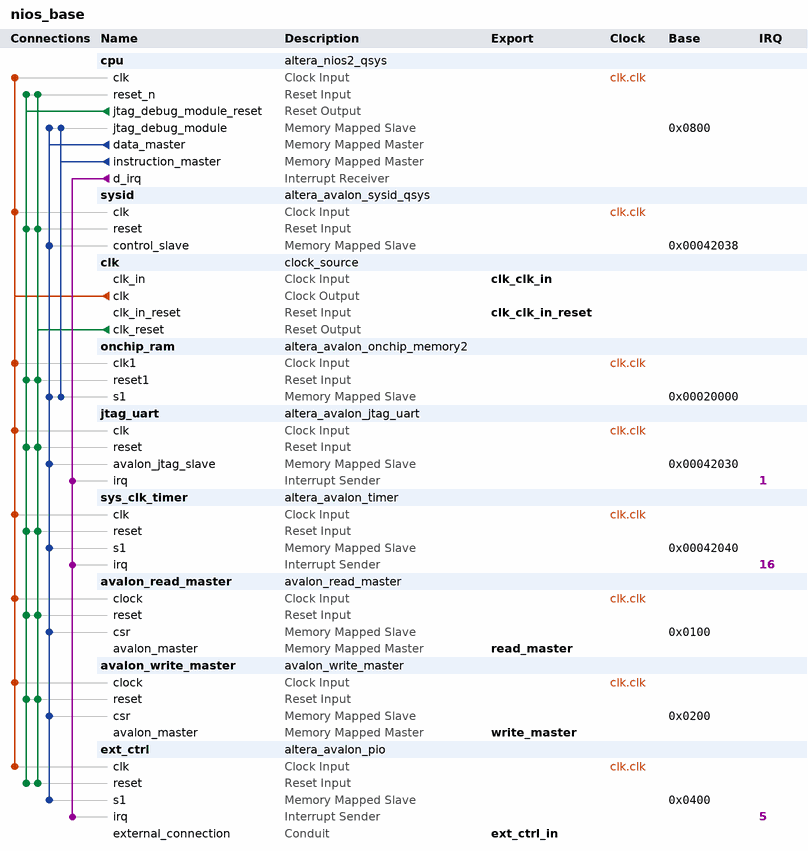
[diagram p0: system contents]
# Platform Designer (Qsys) system nios_base
# Parameters at their usual value, and those the tool derives, are not listed.
package require -exact qsys 11.0
create_system nios_base
set_project_property DEVICE_FAMILY STRATIXIV

add_instance cpu altera_nios2_qsys 11.0
set_instance_parameter_value cpu manuallyAssignCpuID false
set_instance_parameter_value cpu resetSlave onchip_ram.s1
set_instance_parameter_value cpu exceptionSlave onchip_ram.s1
set_instance_parameter_value cpu breakSlave cpu.jtag_debug_module
set_instance_parameter_value cpu muldiv_multiplierType NoneSmall
set_instance_parameter_value cpu mmu_processIDNumBits 10
set_instance_parameter_value cpu impl Tiny
set_instance_parameter_value cpu icache_size 4096

add_instance sysid altera_avalon_sysid_qsys 11.0
set_instance_parameter_value sysid id 953745243

add_instance clk clock_source 11.0
set_instance_parameter_value clk clockFrequency 50000000

add_instance onchip_ram altera_avalon_onchip_memory2 11.0
set_instance_parameter_value onchip_ram dataWidth 32
set_instance_parameter_value onchip_ram dualPort false
set_instance_parameter_value onchip_ram initMemContent true
set_instance_parameter_value onchip_ram initializationFileName onchip_ram
set_instance_parameter_value onchip_ram memorySize 131072

add_instance jtag_uart altera_avalon_jtag_uart 11.0
set_instance_parameter_value jtag_uart simInteractiveOptions INTERACTIVE_ASCII_OUTPUT

add_instance sys_clk_timer altera_avalon_timer 11.0
set_instance_parameter_value sys_clk_timer alwaysRun true
set_instance_parameter_value sys_clk_timer fixedPeriod true
set_instance_parameter_value sys_clk_timer period 10.0
set_instance_parameter_value sys_clk_timer periodUnits MSEC
set_instance_parameter_value sys_clk_timer snapshot false
set_instance_parameter_value sys_clk_timer timerPreset SIMPLE_PERIODIC_INTERRUPT

add_instance avalon_read_master avalon_read_master 1.0
set_instance_parameter_value avalon_read_master DATAWIDTH 32
set_instance_parameter_value avalon_read_master BYTEENABLEWIDTH 4
set_instance_parameter_value avalon_read_master ADDRESSWIDTH 32
set_instance_parameter_value avalon_read_master FIFODEPTH 32
set_instance_parameter_value avalon_read_master FIFODEPTH_LOG2 5
set_instance_parameter_value avalon_read_master FIFOUSEMEMORY 1

add_instance avalon_write_master avalon_write_master 1.0
set_instance_parameter_value avalon_write_master DATAWIDTH 32
set_instance_parameter_value avalon_write_master BYTEENABLEWIDTH 4
set_instance_parameter_value avalon_write_master ADDRESSWIDTH 32
set_instance_parameter_value avalon_write_master FIFODEPTH 32
set_instance_parameter_value avalon_write_master FIFODEPTH_LOG2 5
set_instance_parameter_value avalon_write_master FIFOUSEMEMORY 1

add_instance ext_ctrl altera_avalon_pio 11.0
set_instance_parameter_value ext_ctrl captureEdge true
set_instance_parameter_value ext_ctrl direction Input
set_instance_parameter_value ext_ctrl generateIRQ true
set_instance_parameter_value ext_ctrl irqType EDGE
set_instance_parameter_value ext_ctrl width 4

# connections
add_connection clk.clk avalon_read_master.clock clock
add_connection clk.clk avalon_write_master.clock clock
add_connection clk.clk cpu.clk clock
add_connection clk.clk ext_ctrl.clk clock
add_connection clk.clk jtag_uart.clk clock
add_connection clk.clk onchip_ram.clk1 clock
add_connection clk.clk sys_clk_timer.clk clock
add_connection clk.clk sysid.clk clock
add_connection clk.clk_reset avalon_read_master.reset reset
add_connection clk.clk_reset avalon_write_master.reset reset
add_connection clk.clk_reset cpu.reset_n reset
add_connection clk.clk_reset ext_ctrl.reset reset
add_connection clk.clk_reset jtag_uart.reset reset
add_connection clk.clk_reset onchip_ram.reset1 reset
add_connection clk.clk_reset sys_clk_timer.reset reset
add_connection clk.clk_reset sysid.reset reset
add_connection cpu.jtag_debug_module_reset avalon_read_master.reset reset
add_connection cpu.jtag_debug_module_reset avalon_write_master.reset reset
add_connection cpu.jtag_debug_module_reset cpu.reset_n reset
add_connection cpu.jtag_debug_module_reset ext_ctrl.reset reset
add_connection cpu.jtag_debug_module_reset jtag_uart.reset reset
add_connection cpu.jtag_debug_module_reset onchip_ram.reset1 reset
add_connection cpu.jtag_debug_module_reset sys_clk_timer.reset reset
add_connection cpu.jtag_debug_module_reset sysid.reset reset
add_connection cpu.data_master avalon_read_master.csr avalon
set_connection_parameter_value cpu.data_master/avalon_read_master.csr baseAddress 0x0100
add_connection cpu.data_master avalon_write_master.csr avalon
set_connection_parameter_value cpu.data_master/avalon_write_master.csr baseAddress 0x0200
add_connection cpu.data_master cpu.jtag_debug_module avalon
set_connection_parameter_value cpu.data_master/cpu.jtag_debug_module baseAddress 0x0800
add_connection cpu.data_master ext_ctrl.s1 avalon
set_connection_parameter_value cpu.data_master/ext_ctrl.s1 baseAddress 0x0400
add_connection cpu.data_master jtag_uart.avalon_jtag_slave avalon
set_connection_parameter_value cpu.data_master/jtag_uart.avalon_jtag_slave baseAddress 0x00042030
add_connection cpu.data_master onchip_ram.s1 avalon
set_connection_parameter_value cpu.data_master/onchip_ram.s1 baseAddress 0x00020000
add_connection cpu.data_master sys_clk_timer.s1 avalon
set_connection_parameter_value cpu.data_master/sys_clk_timer.s1 baseAddress 0x00042040
add_connection cpu.data_master sysid.control_slave avalon
set_connection_parameter_value cpu.data_master/sysid.control_slave baseAddress 0x00042038
add_connection cpu.instruction_master cpu.jtag_debug_module avalon
set_connection_parameter_value cpu.instruction_master/cpu.jtag_debug_module baseAddress 0x0800
add_connection cpu.instruction_master onchip_ram.s1 avalon
set_connection_parameter_value cpu.instruction_master/onchip_ram.s1 baseAddress 0x00020000
add_connection cpu.d_irq ext_ctrl.irq interrupt
set_connection_parameter_value cpu.d_irq/ext_ctrl.irq irqNumber 5
add_connection cpu.d_irq jtag_uart.irq interrupt
set_connection_parameter_value cpu.d_irq/jtag_uart.irq irqNumber 1
add_connection cpu.d_irq sys_clk_timer.irq interrupt
set_connection_parameter_value cpu.d_irq/sys_clk_timer.irq irqNumber 16

# exported interfaces
add_interface clk_clk_in clock sink
set_interface_property clk_clk_in EXPORT_OF clk.clk_in
add_interface clk_clk_in_reset reset sink
set_interface_property clk_clk_in_reset EXPORT_OF clk.clk_in_reset
add_interface read_master avalon master
set_interface_property read_master EXPORT_OF avalon_read_master.avalon_master
add_interface write_master avalon master
set_interface_property write_master EXPORT_OF avalon_write_master.avalon_master
add_interface ext_ctrl_in conduit end
set_interface_property ext_ctrl_in EXPORT_OF ext_ctrl.external_connection

save_system nios_base.qsys
